# Altium schematic sheet Sheet2.SchDoc
size A3; Organization: Altium Limited; Address1: L3, 12a Rodborough Rd; Address2: Frenchs Forest; Address3: NSW; Address4: Australia 2086; SheetNumber: 2; SheetTotal: 6
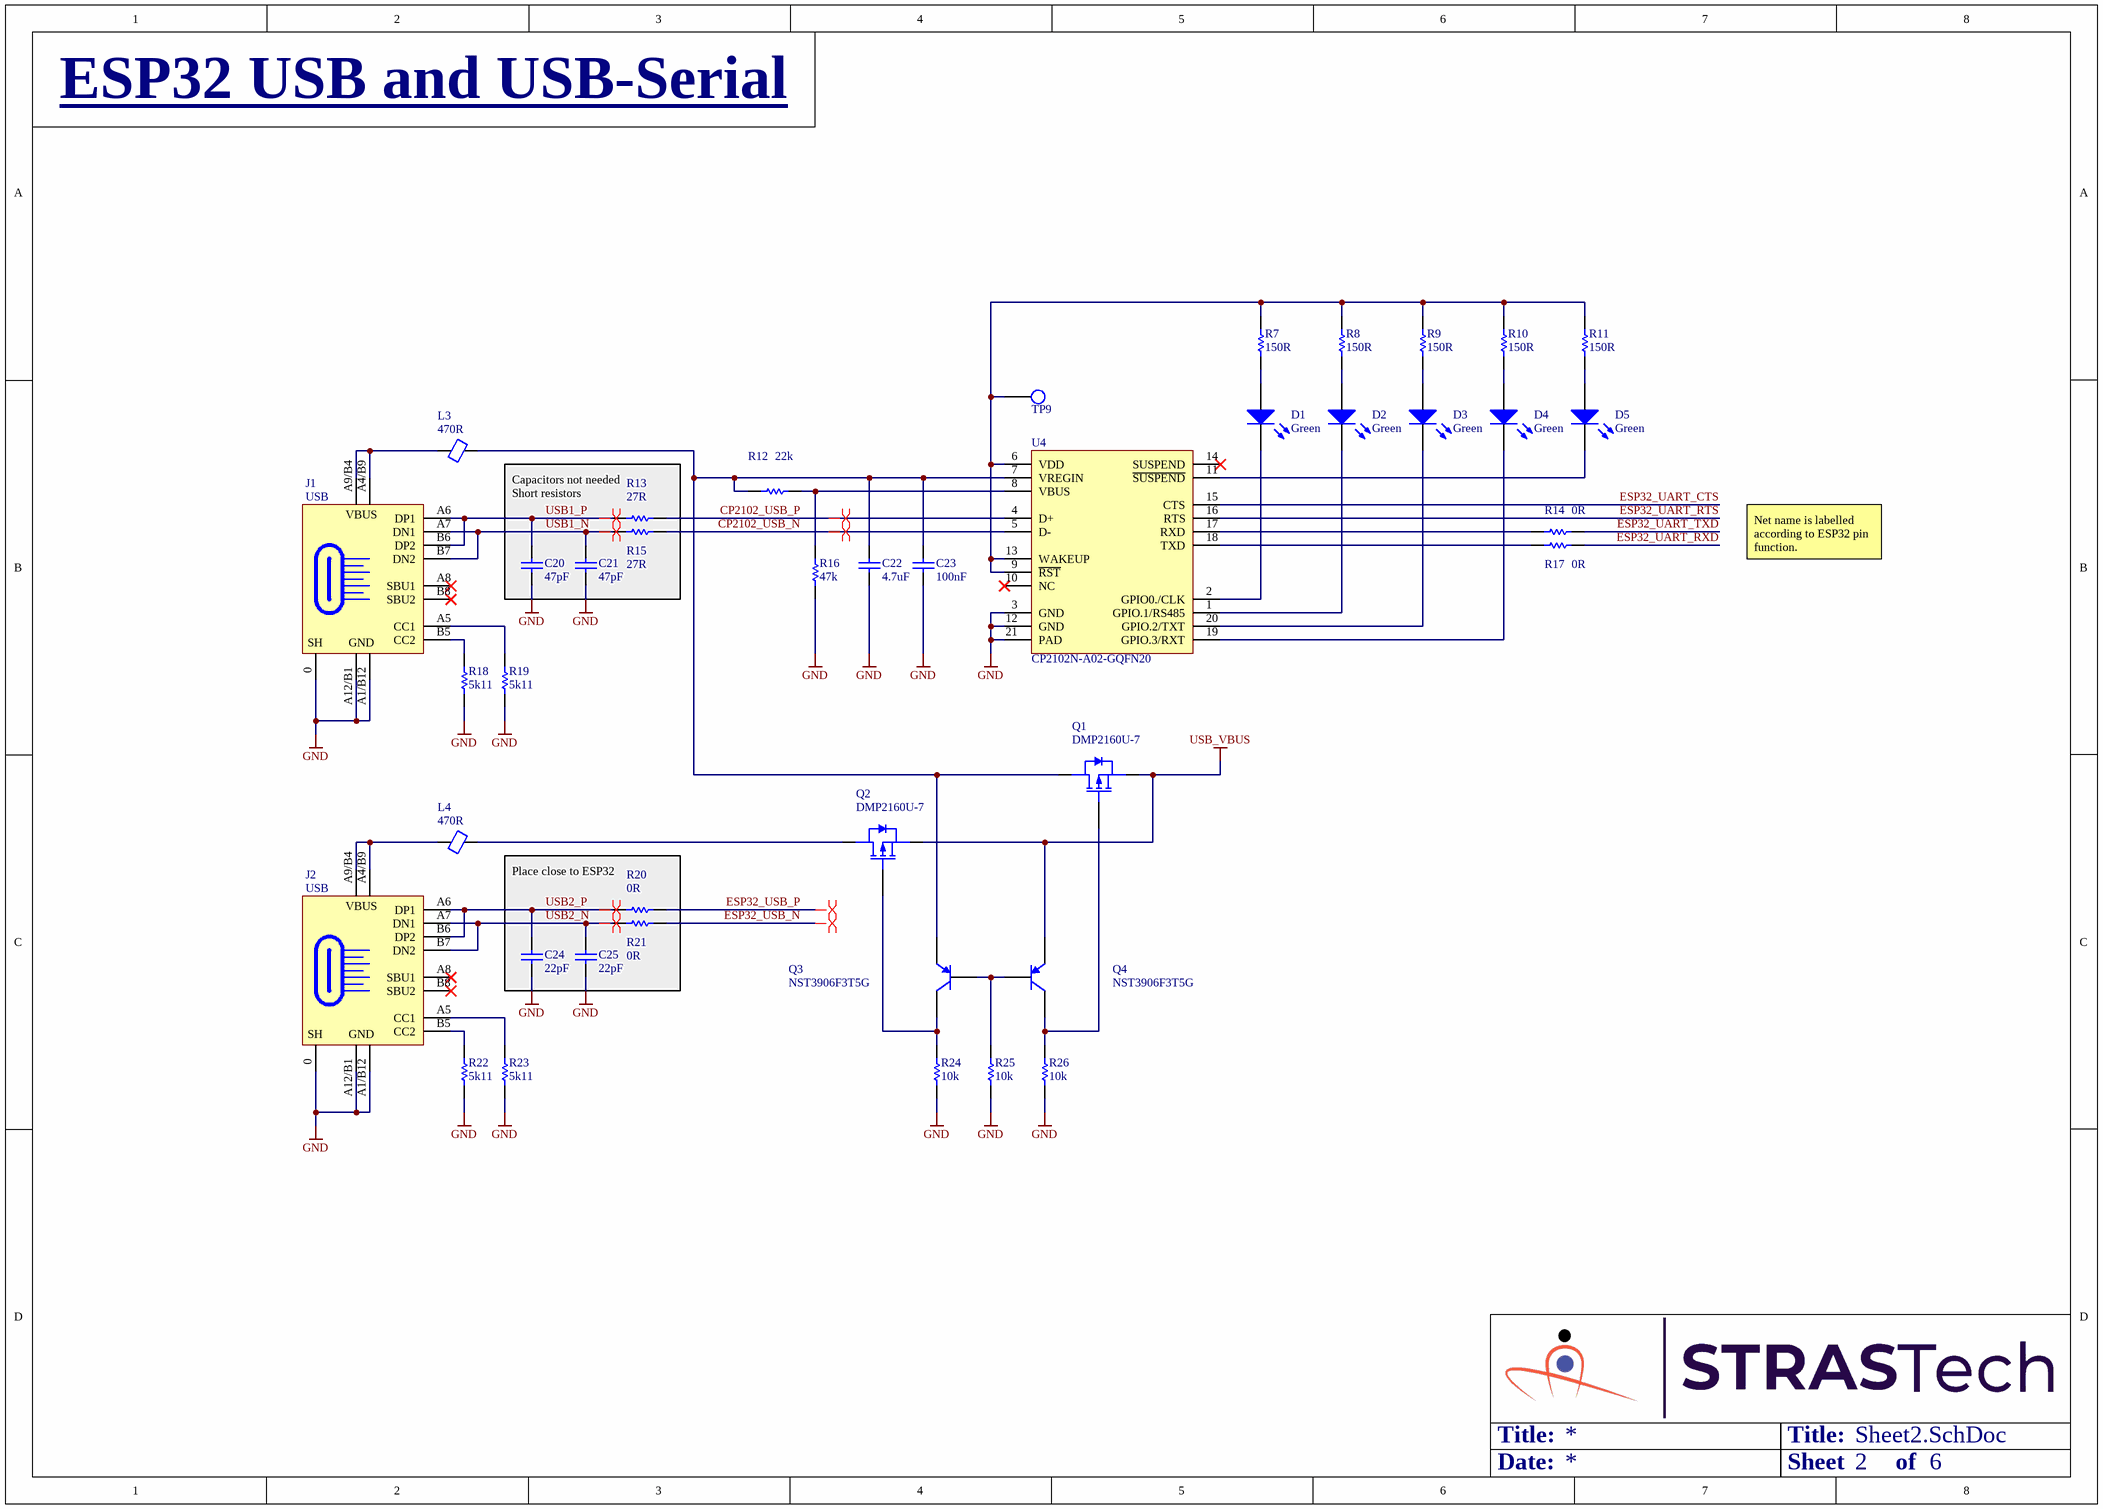
[diagram p0: Sheet2.SchDoc]

## Parts
C20  47pF  [Cap,SMD,0402]
C21  47pF  [Cap,SMD,0402]
C22  4.7uF  [Cap,SMD,0402]
C23  100nF  [Cap,SMD,0402]
C24  22pF  [Cap,SMD,0402]
C25  22pF  [Cap,SMD,0402]
D1  Green  [LED,0603]
D2  Green  [LED,0603]
D3  Green  [LED,0603]
D4  Green  [LED,0603]
D5  Green  [LED,0603]
J1  USB  [CONN,USB_C,SMD]
J2  USB  [CONN,USB_C,SMD]
L3  470R  [IND,0402]
L4  470R  [IND,0402]
Q1  DMP2160U-7  [SOT23-3]
Q2  DMP2160U-7  [SOT23-3]
Q3  NST3906F3T5G  [SOT1123]
Q4  NST3906F3T5G  [SOT1123]
R7  150R  [RES,0402]
R8  150R  [RES,0402]
R9  150R  [RES,0402]
R10  150R  [RES,0402]
R11  150R  [RES,0402]
R12  22k  [RES,0402]
R13  27R  [RES,0402]
R14  0R  [RES,0402]
R15  27R  [RES,0402]
R16  47k  [RES,0402]
R17  0R  [RES,0402]
R18  5k11  [RES,0402]
R19  5k11  [RES,0402]
R20  0R  [RES,0402]
R21  0R  [RES,0402]
R22  5k11  [RES,0402]
R23  5k11  [RES,0402]
R24  10k  [RES,0402]
R25  10k  [RES,0402]
R26  10k  [RES,0402]
TP9  TESTPOINT  [testpoint,smd,round,1mm]  (value not drawn)
U4  CP2102N-A02-GQFN20  [IC,QFN-20,3x3,PAD]

## Nets
GND: C20.1 C21.1 C22.1 C23.1 C24.1 C25.1 J1.0(SHIELD) J1.A1/B12(GND) J1.A12/B1(GND) J2.0(SHIELD) J2.A1/B12(GND) J2.A12/B1(GND) R16.1 R18.1 R19.1 R22.1 R23.1 R24.2 R25.2 R26.2 U4.3(GND) U4.12(GND) U4.21(PAD)
USB_VBUS: Q1.2(S) Q2.2(S) Q4.2(E)
CP2102_USB_N: R15.2 U4.5(D-)
CP2102_USB_P: R13.2 U4.4(D+)
ESP32_UART_CTS: U4.15(CTS)
ESP32_UART_RTS: U4.16(RTS)
ESP32_UART_RXD: R17.2
ESP32_UART_TXD: R14.2
ESP32_USB_N: R21.2
ESP32_USB_P: R20.2
USB1_N: C21.2 J1.A7(DN1) J1.B7(DN2) R15.1
USB1_P: C20.2 J1.A6(DP1) J1.B6(DP2) R13.1
USB2_N: C25.2 J2.A7(DN1) J2.B7(DN2) R21.1
USB2_P: C24.2 J2.A6(DP1) J2.B6(DP2) R20.1
NetC22_2: C22.2 C23.2 L3.2 Q1.3(D) Q3.2(E) R12.1 U4.7(VREGIN)
NetD1_1: D1.1(A) R7.1
NetD1_2: D1.2(K) U4.2(GPIO0./CLK)
NetD2_1: D2.1(A) R8.1
NetD2_2: D2.2(K) U4.1(GPIO.1/RS485)
NetD3_1: D3.1(A) R9.1
NetD3_2: D3.2(K) U4.20(GPIO.2/TXT)
NetD4_1: D4.1(A) R10.1
NetD4_2: D4.2(K) U4.19(GPIO.3/RXT)
NetD5_1: D5.1(A) R11.1
NetD5_2: D5.2(K) U4.11(~{SUSPEND})
NetJ1_A4/B9: J1.A4/B9(VBUS) J1.A9/B4(VBUS) L3.1
NetJ1_A5: J1.A5(CC1) R19.2
NetJ1_B5: J1.B5(CC2) R18.2
NetJ2_A4/B9: J2.A4/B9(VBUS) J2.A9/B4(VBUS) L4.1
NetJ2_A5: J2.A5(CC1) R23.2
NetJ2_B5: J2.B5(CC2) R22.2
NetL4_2: L4.2 Q2.3(D)
NetQ1_1: Q1.1(G) Q4.3(C) R26.1
NetQ2_1: Q2.1(G) Q3.3(C) R24.1
NetQ3_1: Q3.1(B) Q4.1(B) R25.1
NetR7_2: R7.2 R8.2 R9.2 R10.2 R11.2 TP9.1(TP) U4.6(VDD) U4.9(~{RST}) U4.13(WAKEUP)
NetR12_2: R12.2 R16.2 U4.8(VBUS)
NetR14_1: R14.1 U4.17(RXD)
NetR17_1: R17.1 U4.18(TXD)

Not connected (* = marked no-connect by the designer): J1 A8(SBU1)* B8(SBU2)*; J2 A8(SBU1)* B8(SBU2)*; U4 10(NC)* 14(SUSPEND)*

## Layout directives
differential pair: CP2102_USB_N, CP2102_USB_P, ESP32_USB_N, ESP32_USB_P, USB1_N, USB1_P, USB2_N, USB2_P

## Notes on the sheet
- ESP32 USB and USB-Serial
- Net name is labelled according to ESP32 pin function.
- Capacitors not needed
  Short resistors
- Place close to ESP32
- Title:
- Date:
- Sheet
- of
- Title
- Size:
- A3
- Revision:
- Design By:
- (in symbol Conn,USB_C,SMD) SH

## Library data of the parts
C20 C21 = CAP,Cer,47pF,50VDC,C0G/NP0,0402: 47pF ±5% 50V Ceramic Capacitor C0G, NP0 0402 (1005 Metric); Vendor Part Number: 1292-1325-1-ND; Manufacturer: Walsin Technology Corporation; Manufacturer Part Number: 0402N470J500CT; Vendor: Digikey; HelpURL: http://www.passivecomponent.com/wp-content/uploads/2018/10/MLCC.pdf; CreatedBy: Judd Foster
C22 = CAP,Cer,4.7uF,16VDC,X5R,0402: 4.7 µF ±20% 16V Ceramic Capacitor X5R 0402 (1005 Metric); Vendor Part Number: 478-10788-1-ND; Manufacturer: AVX Corporation; Manufacturer Part Number: 0402YD475MAT2A; Vendor: Digikey; HelpURL: https://datasheets.avx.com/cx5r.pdf; CreatedBy: Judd Foster
C23 = CAP,Cer,100nF,25VDC,X7R,0402: 0.1µF ±10% 25V Ceramic Capacitor X7R 0402 (1005 Metric); Vendor Part Number: 490-14603-1-ND; Manufacturer: Murata Electronics; Manufacturer Part Number: GRM155R71E104KE14J; Vendor: Digikey; HelpURL: https://search.murata.co.jp/Ceramy/image/img/A01X/G101/ENG/GRM155R71E104KE14-01.pdf; CreatedBy: Judd Foster
C24 C25 = CAP,Cer,22pF,25VDC,C0G/NP0,0402: 22pF ±5% 25V Ceramic Capacitor C0G, NP0 0402 (1005 Metric); Vendor Part Number: 1292-1282-1-ND; Manufacturer: Walsin Technology Corporation; Manufacturer Part Number: 0402N220J250CT; Vendor: Digikey; HelpURL: http://www.passivecomponent.com/wp-content/uploads/ecd/0402N220J250CT-IN.pdf; CreatedBy: Judd Foster
D1-D5 = LED,Green,SMD,0603: Green 530nm LED Indication - Discrete 3V 0603 (1608 Metric); Manufacturer: Stanley Electric Co; Manufacturer Part Number: THG1111C-0005-TR; Vendor Part Number: 404-1286-1-ND; Vendor: Digikey; CreatedBy: Judd Foster; HelpURL: http://www.stanley-components.com/php/downloaddatafile.php?rp=0,THG1111C-0005_e.pdf
J1 J2 = Conn,USB_C,SMD: USB-C (USB TYPE-C) USB 2.0 Receptacle Connector 24 (16+8 Dummy) Position Surface Mount, Right Angle; Manufacturer: GCT; Manufacturer Part Number: USB4110-GF-A; Vendor Part Number: 2073-USB4110-GF-A-1-ND; Vendor: Digikey; CreatedBy: Judd Foster; HelpURL: https://gct.co/files/drawings/usb4110.pdf
L3 L4 = Ferrite,470R@100MHz,0402: 470 Ohms @ 100 MHz 1 Power Line Ferrite Bead 0402 (1005 Metric) 1A 200mOhm; Vendor Part Number: 490-10662-1-ND; Manufacturer: Murata Electronics; Manufacturer Part Number: BLM15PX471SN1D; Vendor: Digikey; HelpURL: https://www.murata.com/en-us/products/productdata/8796740059166/ENFA0018.pdf; CreatedBy: Judd Foster
Q1 Q2 = MOSFET,P Ch,20V,3.2A: P-Channel 20 V 3.2A (Ta) 1.4W (Ta) Surface Mount SOT-23-3; Manufacturer: Diodes Incorporated; Vendor Part Number: DMP2160UDICT-ND; Vendor: Digikey; CreatedBy: Judd Foster; HelpURL: https://media.digikey.com/pdf/Data%20Sheets/Diodes%20PDFs/DMP2160U.pdf; Manufacturer Part Number: DMP2160U-7
Q3 Q4 = Trans,PNP,40V,200mA,SOT1123: Bipolar (BJT) Transistor PNP 40 V 200 mA 250MHz 290 mW Surface Mount SOT-1123; Manufacturer: ON Semiconductor; Vendor Part Number: NST3906F3T5GOSCT-ND; Vendor: Digikey; CreatedBy: Judd Foster; HelpURL: https://www.onsemi.com/pdf/datasheet/nst3906f3-d.pdf; Manufacturer Part Number: NST3906F3T5G
R7-R11 = RES,150R,1%,0.1W,0402: 150 Ohms ±1% 0.063W, 1/16W Chip Resistor 0402 (1005 Metric) Automotive AEC-Q200, Moisture Resistant Thick Film; Manufacturer: TE Connectivity Passive Product; Manufacturer Part Number: CRGCQ0402F150R; Vendor Part Number: A129617CT-ND; Vendor: Digikey; CreatedBy: Judd Foster; HelpURL: https://www.te.com/commerce/DocumentDelivery/DDEController?Action=srchrtrv&DocNm=1773204-3&DocType=DS&DocLang=English
R12 = RES,22k,1%,0.063W,0402: 22 kOhms ±1% 0.063W, 1/16W Chip Resistor 0402 (1005 Metric) Automotive AEC-Q200 Thick Film; Vendor Part Number: RMCF0402FT22K0CT-ND; Manufacturer: Stackpole Electronics Inc; Manufacturer Part Number: RMCF0402FT22K0; Vendor: DIgikey; HelpURL: https://www.seielect.com/catalog/sei-rmcf_rmcp.pdf; CreatedBy: Judd Foster
R13 R15 = RES,27R,5%,0.063W,0402: 27 Ohms ±5% 0.063W, 1/16W Chip Resistor 0402 (1005 Metric) Automotive AEC-Q200 Thick Film; Vendor Part Number: RMCF0402JT27R0CT-ND; Manufacturer: Stackpole Electronics Inc; Manufacturer Part Number: RMCF0402JT27R0; Vendor: DIgikey; HelpURL: https://www.seielect.com/catalog/sei-rmcf_rmcp.pdf; CreatedBy: Judd Foster
R14 R17 R20 R21 = RES,0R0,0.1W,0402: 0 Ohms Jumper 0.1W, 1/10W Chip Resistor 0402 (1005 Metric) Automotive AEC-Q200 Thick Film; Manufacturer: Panasonic Electronic Components; Manufacturer Part Number: ERJ-2GE0R00X; Vendor Part Number: P0.0JCT-ND; Vendor: Digikey; CreatedBy: Judd Foster; HelpURL: https://industrial.panasonic.com/cdbs/www-data/pdf/RDA0000/AOA0000C301.pdf
R16 = RES,47k,1%,0.1W,0402: 47 kOhms ±1% 0.1W, 1/10W Chip Resistor 0402 (1005 Metric) Automotive AEC-Q200 Thick Film; Manufacturer: Panasonic Electronic Components; Manufacturer Part Number: ERJ-2RKF4702X; Vendor Part Number: P47.0KLCT-ND; Vendor: Digikey; CreatedBy: Judd Foster; HelpURL: https://industrial.panasonic.com/cdbs/www-data/pdf/RDA0000/AOA0000C304.pdf
R18 R19 R22 R23 = RES,5k11,1%,0.063W,0402: 5.11 kOhms ±1% 0.063W, 1/16W Chip Resistor 0402 (1005 Metric) Automotive AEC-Q200, Moisture Resistant Thick Film; Manufacturer: Yageo; Manufacturer Part Number: AC0402FR-075K11L; Vendor Part Number: 13-AC0402FR-075K11LCT-ND; Vendor: Digikey; CreatedBy: Judd Foster; HelpURL: https://www.yageo.com/upload/media/product/productsearch/datasheet/rchip/PYu-AC_51_RoHS_L_7.pdf
R24-R26 = RES,10k,5%,0.063W,0402: 10 kOhms ±5% 0.063W, 1/16W Chip Resistor 0402 (1005 Metric) Automotive AEC-Q200 Thick Film; Vendor Part Number: RMCF0402JT10K0CT-ND; Manufacturer: Stackpole Electronics Inc; Manufacturer Part Number: RMCF0402JT10K0; Vendor: DIgikey; HelpURL: https://www.seielect.com/catalog/sei-rmcf_rmcp.pdf; CreatedBy: Judd Foster
TP9 = TESTPOINT: PCB Testpoint; CreatedBy: Judd Foster; HelpURL: N/A; Manufacturer: N/A; Manufacturer Part Number: N/A; Vendor: N/A; Vendor Part Number: N/A
U4 = CP2102N-A02-GQFN20: USB Bridge, USB to UART USB 2.0 UART Interface 20-QFN (3x3); Manufacturer: Silicon Labs; Vendor Part Number: 336-5885-ND; Vendor: Digikey; CreatedBy: Judd Foster; HelpURL: https://www.silabs.com/documents/public/data-sheets/cp2102n-datasheet.pdf; Manufacturer Part Number: CP2102N-A02-GQFN20